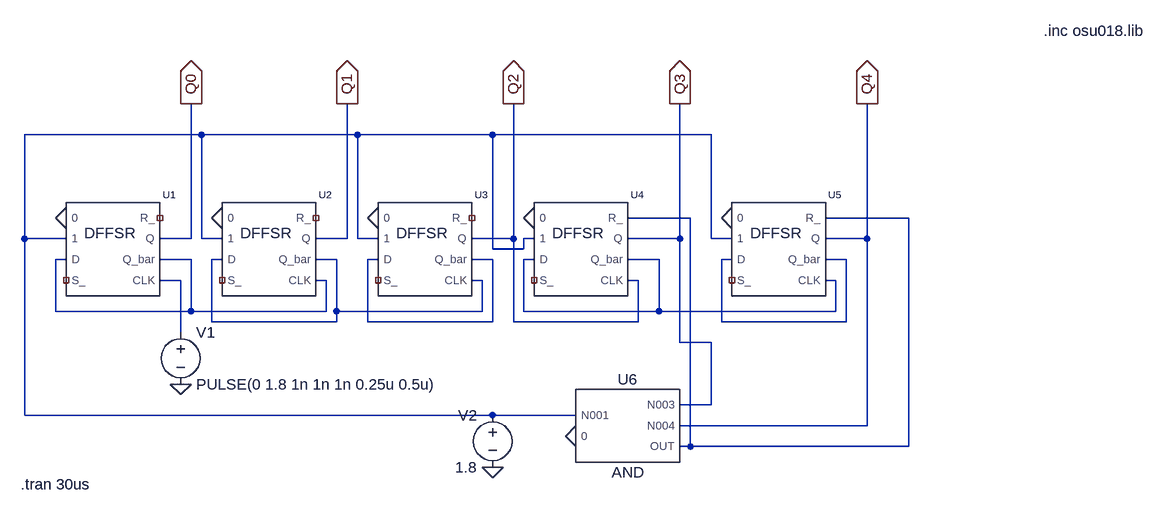
[diagram p0: schematic CLK_divider_CMOS.asc]
CLK_divider_CMOS.asc, the LTspice schematic file:
Version 4
SHEET 1 1244 680
WIRE -224 -32 -496 -32
WIRE 16 -32 -224 -32
WIRE 224 -32 16 -32
WIRE 560 -32 224 -32
WIRE 528 96 432 96
WIRE 864 96 736 96
WIRE -496 128 -496 -32
WIRE -432 128 -496 128
WIRE -240 128 -240 -80
WIRE -240 128 -288 128
WIRE -224 128 -224 -32
WIRE -192 128 -224 128
WIRE 0 128 0 -80
WIRE 0 128 -48 128
WIRE 16 128 16 -32
WIRE 48 128 16 128
WIRE 256 128 256 -80
WIRE 256 128 192 128
WIRE 288 128 272 128
WIRE 512 128 512 -80
WIRE 512 128 432 128
WIRE 560 128 560 -32
WIRE 592 128 560 128
WIRE 800 128 800 -80
WIRE 800 128 736 128
WIRE 224 144 224 -32
WIRE 272 144 272 128
WIRE 272 144 224 144
WIRE -432 160 -448 160
WIRE -240 160 -288 160
WIRE -192 160 -208 160
WIRE -16 160 -48 160
WIRE 48 160 32 160
WIRE 224 160 192 160
WIRE 288 160 272 160
WIRE 480 160 432 160
WIRE 592 160 576 160
WIRE 768 160 736 160
WIRE -256 192 -288 192
WIRE -32 192 -48 192
WIRE 208 192 192 192
WIRE 448 192 432 192
WIRE 752 192 736 192
WIRE -448 240 -448 160
WIRE -240 240 -240 160
WIRE -240 240 -448 240
WIRE -32 240 -32 192
WIRE -32 240 -240 240
WIRE -16 240 -16 160
WIRE 208 240 208 192
WIRE 208 240 -16 240
WIRE 272 240 272 160
WIRE 480 240 480 160
WIRE 480 240 272 240
WIRE 752 240 752 192
WIRE 752 240 480 240
WIRE -208 256 -208 160
WIRE -16 256 -16 240
WIRE -16 256 -208 256
WIRE 32 256 32 160
WIRE 224 256 224 160
WIRE 224 256 32 256
WIRE 256 256 256 128
WIRE 448 256 448 192
WIRE 448 256 256 256
WIRE 576 256 576 160
WIRE 768 256 768 160
WIRE 768 256 576 256
WIRE -256 272 -256 192
WIRE 512 288 512 128
WIRE 560 288 512 288
WIRE 560 384 560 288
WIRE 560 384 512 384
WIRE -496 400 -496 128
WIRE 224 400 -496 400
WIRE 352 400 224 400
WIRE 800 416 800 128
WIRE 800 416 512 416
WIRE 528 448 528 96
WIRE 528 448 512 448
WIRE 864 448 864 96
WIRE 864 448 528 448
FLAG -256 352 0
FLAG -240 -80 Q0
IOPIN -240 -80 Out
FLAG 0 -80 Q1
IOPIN 0 -80 Out
FLAG 256 -80 Q2
IOPIN 256 -80 Out
FLAG 512 -80 Q3
IOPIN 512 -80 Out
FLAG 800 -80 Q4
IOPIN 800 -80 Out
FLAG -432 96 0
FLAG -192 96 0
FLAG 48 96 0
FLAG 288 96 0
FLAG 592 96 0
FLAG 352 432 0
FLAG 224 480 0
SYMBOL DFFSR_Qbar -368 144 R0
SYMATTR InstName U1
SYMBOL DFFSR_Qbar -128 144 R0
SYMATTR InstName U2
SYMBOL DFFSR_Qbar 112 144 R0
SYMATTR InstName U3
SYMBOL DFFSR_Qbar 352 144 R0
SYMATTR InstName U4
SYMBOL DFFSR_Qbar 656 144 R0
SYMATTR InstName U5
SYMBOL voltage -256 256 R0
WINDOW 123 0 0 Left 0
WINDOW 39 0 0 Left 0
SYMATTR InstName V1
SYMATTR Value PULSE(0 1.8 1n 1n 1n 0.25u 0.5u)
SYMBOL AND_new 432 416 R0
SYMATTR InstName U6
SYMBOL voltage 224 384 M0
WINDOW 123 0 0 Left 0
WINDOW 39 0 0 Left 0
SYMATTR InstName V2
SYMATTR Value 1.8
TEXT 1072 -192 Left 2 !.inc osu018.lib
TEXT -502 506 Left 2 !.tran 30us

The netlist it stands for:
* CLK_divider_CMOS.asc
XU1 0 N001 N003 NC_01 NC_02 Q0 N003 N008 DFFSR  ; pins 0 1 D S_ R_ Q Q_bar CLK
XU2 0 N001 N004 NC_03 NC_04 Q1 N004 N003 DFFSR  ; pins 0 1 D S_ R_ Q Q_bar CLK
XU3 0 N001 N005 NC_05 NC_06 Q2 N005 N004 DFFSR  ; pins 0 1 D S_ R_ Q Q_bar CLK
XU4 0 N001 N006 NC_07 N002 Q3 N006 Q2 DFFSR  ; pins 0 1 D S_ R_ Q Q_bar CLK
XU5 0 N001 N007 NC_08 N002 Q4 N007 N006 DFFSR  ; pins 0 1 D S_ R_ Q Q_bar CLK
V1 N008 0 PULSE(0 1.8 1n 1n 1n 0.25u 0.5u)
XU6 N001 0 Q3 Q4 N002 AND  ; pins N001 0 N003 N004 OUT
V2 N001 0 1.8
.inc osu018.lib
.tran 30us
.lib C:\Users\ananya\Documents\LTspiceXVII\active_high_with_qbar.cir
.lib C:\Users\ananya\Documents\LTspiceXVII\ADC.cir
.backanno
.end